# Altium schematic sheet SchemaM02.SchDoc
size A3
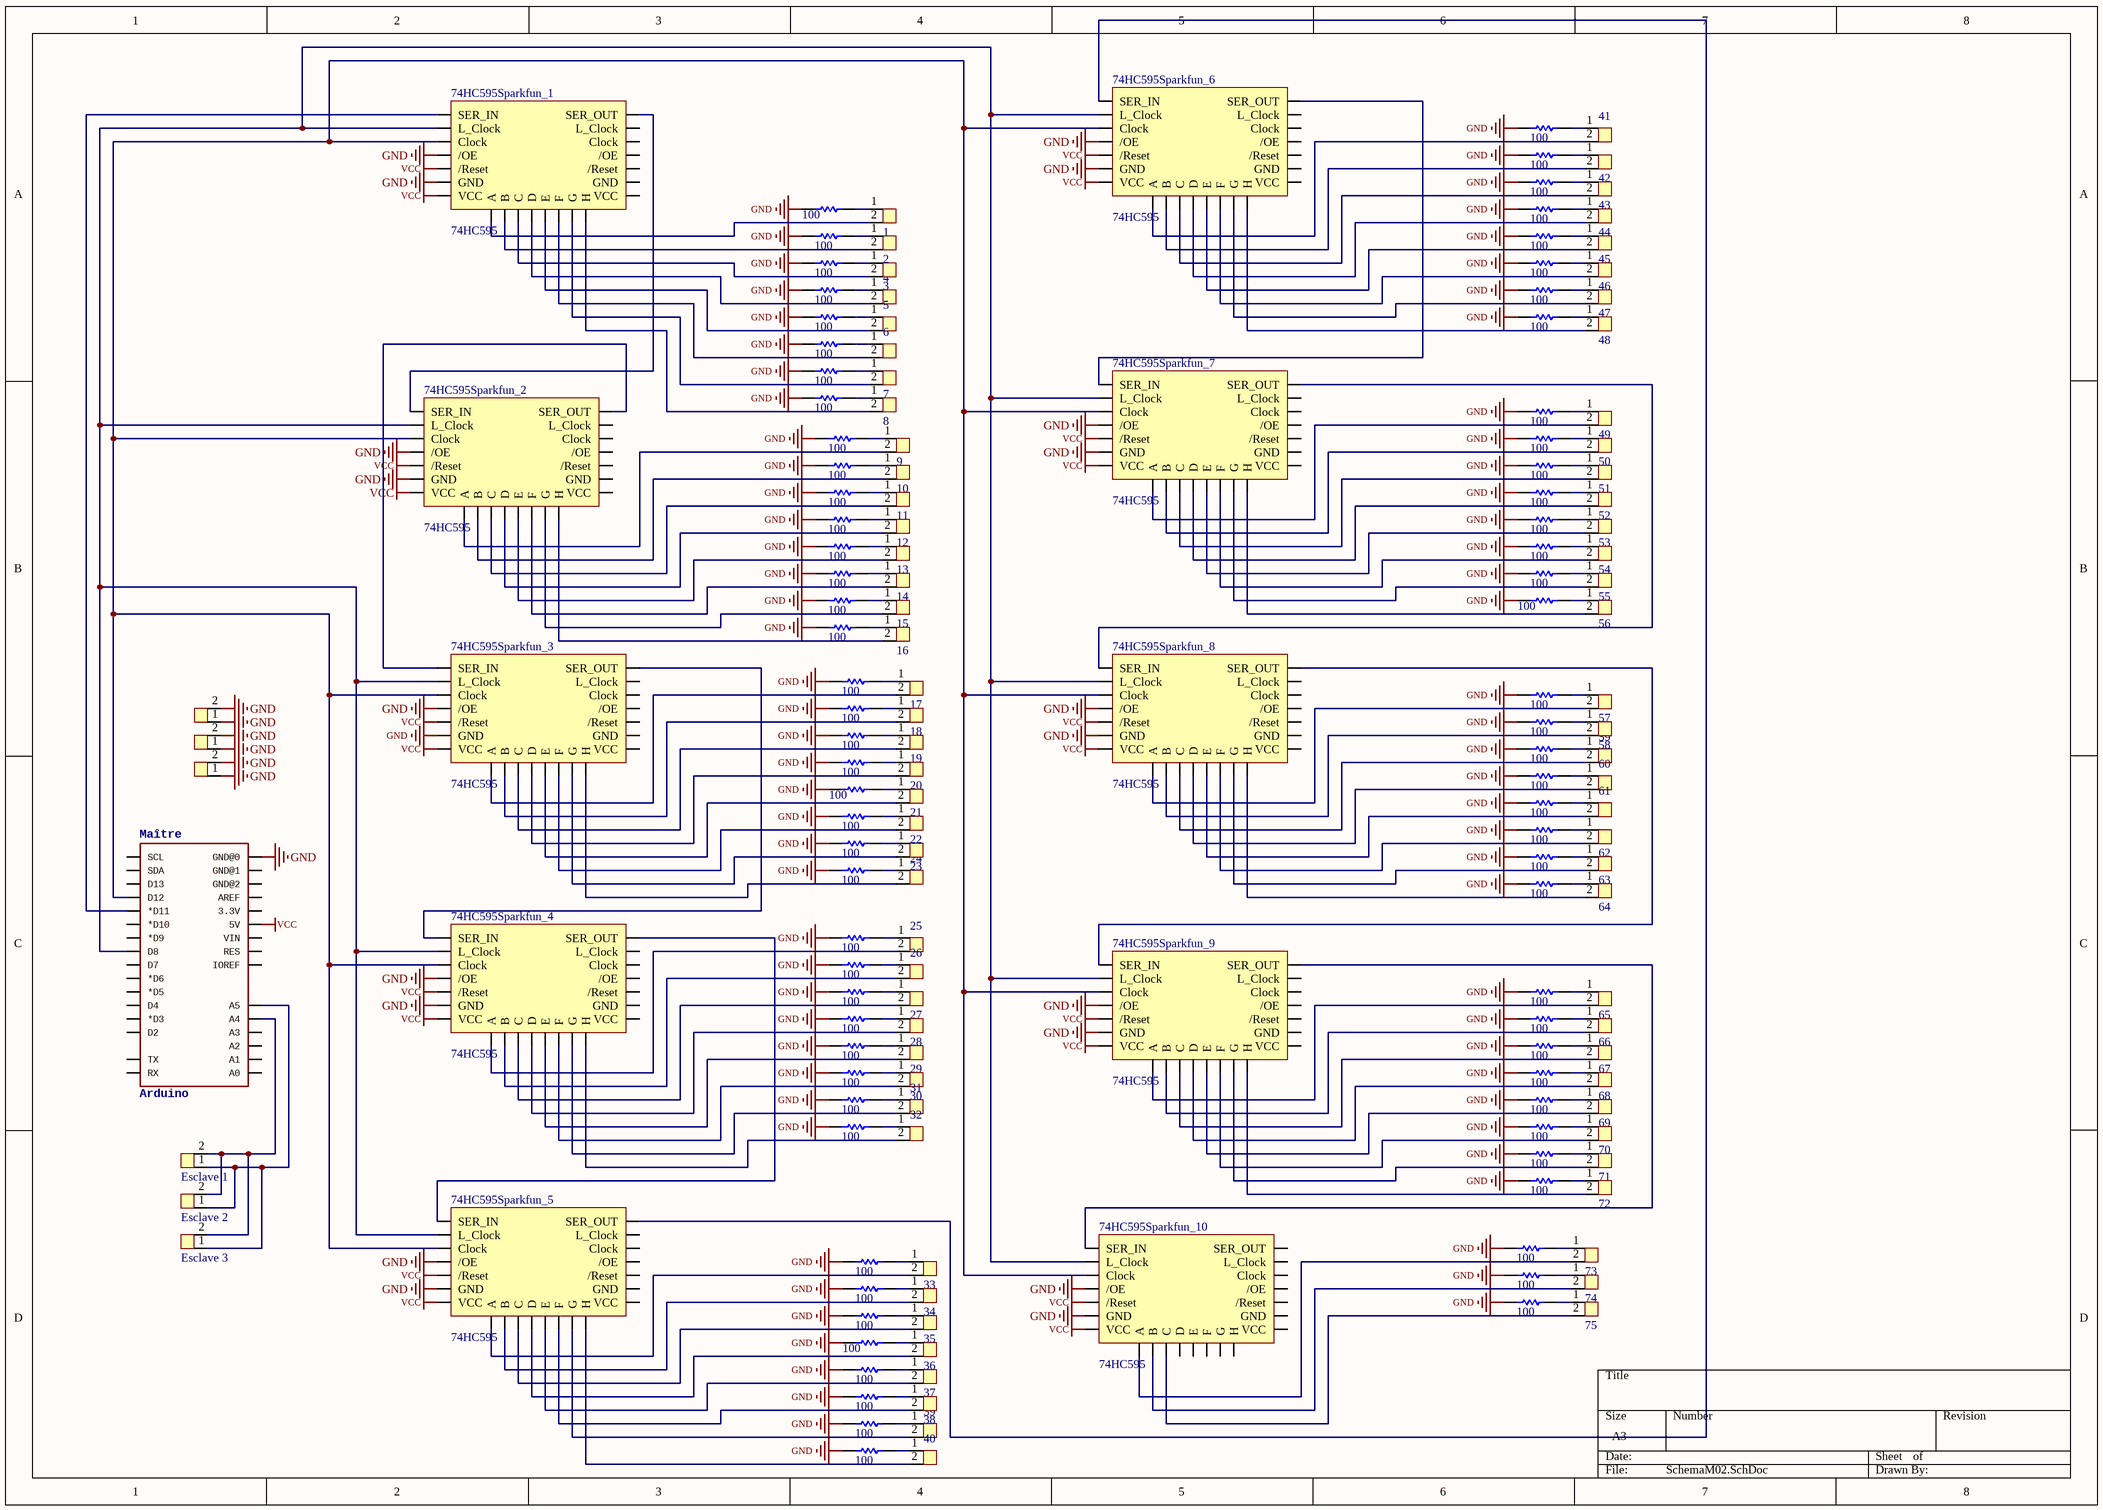
[diagram p0: SchemaM02.SchDoc]

## Parts
1  Embase_CI_2_contacts  [Embase_CI_2_contacts]  (value not drawn)
2  Embase_CI_2_contacts  [Embase_CI_2_contacts]  (value not drawn)
3  Embase_CI_2_contacts  [Embase_CI_2_contacts]  (value not drawn)
4  Embase_CI_2_contacts  [Embase_CI_2_contacts]  (value not drawn)
5  Embase_CI_2_contacts  [Embase_CI_2_contacts]  (value not drawn)
6  Embase_CI_2_contacts  [Embase_CI_2_contacts]  (value not drawn)
7  Embase_CI_2_contacts  [Embase_CI_2_contacts]  (value not drawn)
8  Embase_CI_2_contacts  [Embase_CI_2_contacts]  (value not drawn)
9  Embase_CI_2_contacts  [Embase_CI_2_contacts]  (value not drawn)
10  Embase_CI_2_contacts  [Embase_CI_2_contacts]  (value not drawn)
11  Embase_CI_2_contacts  [Embase_CI_2_contacts]  (value not drawn)
12  Embase_CI_2_contacts  [Embase_CI_2_contacts]  (value not drawn)
13  Embase_CI_2_contacts  [Embase_CI_2_contacts]  (value not drawn)
14  Embase_CI_2_contacts  [Embase_CI_2_contacts]  (value not drawn)
15  Embase_CI_2_contacts  [Embase_CI_2_contacts]  (value not drawn)
16  Embase_CI_2_contacts  [Embase_CI_2_contacts]  (value not drawn)
17  Embase_CI_2_contacts  [Embase_CI_2_contacts]  (value not drawn)
18  Embase_CI_2_contacts  [Embase_CI_2_contacts]  (value not drawn)
19  Embase_CI_2_contacts  [Embase_CI_2_contacts]  (value not drawn)
20  Embase_CI_2_contacts  [Embase_CI_2_contacts]  (value not drawn)
21  Embase_CI_2_contacts  [Embase_CI_2_contacts]  (value not drawn)
22  Embase_CI_2_contacts  [Embase_CI_2_contacts]  (value not drawn)
23  Embase_CI_2_contacts  [Embase_CI_2_contacts]  (value not drawn)
24  Embase_CI_2_contacts  [Embase_CI_2_contacts]  (value not drawn)
25  Embase_CI_2_contacts  [Embase_CI_2_contacts]  (value not drawn)
26  Embase_CI_2_contacts  [Embase_CI_2_contacts]  (value not drawn)
27  Embase_CI_2_contacts  [Embase_CI_2_contacts]  (value not drawn)
28  Embase_CI_2_contacts  [Embase_CI_2_contacts]  (value not drawn)
29  Embase_CI_2_contacts  [Embase_CI_2_contacts]  (value not drawn)
30  Embase_CI_2_contacts  [Embase_CI_2_contacts]  (value not drawn)
31  Embase_CI_2_contacts  [Embase_CI_2_contacts]  (value not drawn)
32  Embase_CI_2_contacts  [Embase_CI_2_contacts]  (value not drawn)
33  Embase_CI_2_contacts  [Embase_CI_2_contacts]  (value not drawn)
34  Embase_CI_2_contacts  [Embase_CI_2_contacts]  (value not drawn)
35  Embase_CI_2_contacts  [Embase_CI_2_contacts]  (value not drawn)
36  Embase_CI_2_contacts  [Embase_CI_2_contacts]  (value not drawn)
37  Embase_CI_2_contacts  [Embase_CI_2_contacts]  (value not drawn)
38  Embase_CI_2_contacts  [Embase_CI_2_contacts]  (value not drawn)
39  Embase_CI_2_contacts  [Embase_CI_2_contacts]  (value not drawn)
40  Embase_CI_2_contacts  [Embase_CI_2_contacts]  (value not drawn)
41  Embase_CI_2_contacts  [Embase_CI_2_contacts]  (value not drawn)
42  Embase_CI_2_contacts  [Embase_CI_2_contacts]  (value not drawn)
43  Embase_CI_2_contacts  [Embase_CI_2_contacts]  (value not drawn)
44  Embase_CI_2_contacts  [Embase_CI_2_contacts]  (value not drawn)
45  Embase_CI_2_contacts  [Embase_CI_2_contacts]  (value not drawn)
46  Embase_CI_2_contacts  [Embase_CI_2_contacts]  (value not drawn)
47  Embase_CI_2_contacts  [Embase_CI_2_contacts]  (value not drawn)
48  Embase_CI_2_contacts  [Embase_CI_2_contacts]  (value not drawn)
49  Embase_CI_2_contacts  [Embase_CI_2_contacts]  (value not drawn)
50  Embase_CI_2_contacts  [Embase_CI_2_contacts]  (value not drawn)
51  Embase_CI_2_contacts  [Embase_CI_2_contacts]  (value not drawn)
52  Embase_CI_2_contacts  [Embase_CI_2_contacts]  (value not drawn)
53  Embase_CI_2_contacts  [Embase_CI_2_contacts]  (value not drawn)
54  Embase_CI_2_contacts  [Embase_CI_2_contacts]  (value not drawn)
55  Embase_CI_2_contacts  [Embase_CI_2_contacts]  (value not drawn)
56  Embase_CI_2_contacts  [Embase_CI_2_contacts]  (value not drawn)
57  Embase_CI_2_contacts  [Embase_CI_2_contacts]  (value not drawn)
58  Embase_CI_2_contacts  [Embase_CI_2_contacts]  (value not drawn)
59  Embase_CI_2_contacts  [Embase_CI_2_contacts]  (value not drawn)
60  Embase_CI_2_contacts  [Embase_CI_2_contacts]  (value not drawn)
61  Embase_CI_2_contacts  [Embase_CI_2_contacts]  (value not drawn)
62  Embase_CI_2_contacts  [Embase_CI_2_contacts]  (value not drawn)
63  Embase_CI_2_contacts  [Embase_CI_2_contacts]  (value not drawn)
64  Embase_CI_2_contacts  [Embase_CI_2_contacts]  (value not drawn)
65  Embase_CI_2_contacts  [Embase_CI_2_contacts]  (value not drawn)
66  Embase_CI_2_contacts  [Embase_CI_2_contacts]  (value not drawn)
67  Embase_CI_2_contacts  [Embase_CI_2_contacts]  (value not drawn)
68  Embase_CI_2_contacts  [Embase_CI_2_contacts]  (value not drawn)
69  Embase_CI_2_contacts  [Embase_CI_2_contacts]  (value not drawn)
70  Embase_CI_2_contacts  [Embase_CI_2_contacts]  (value not drawn)
71  Embase_CI_2_contacts  [Embase_CI_2_contacts]  (value not drawn)
72  Embase_CI_2_contacts  [Embase_CI_2_contacts]  (value not drawn)
73  Embase_CI_2_contacts  [Embase_CI_2_contacts]  (value not drawn)
74  Embase_CI_2_contacts  [Embase_CI_2_contacts]  (value not drawn)
74HC595Sparkfun_1  74HC595  [74HC595]
74HC595Sparkfun_2  74HC595  [74HC595]
74HC595Sparkfun_3  74HC595  [74HC595]
74HC595Sparkfun_4  74HC595  [74HC595]
74HC595Sparkfun_5  74HC595  [74HC595]
74HC595Sparkfun_6  74HC595  [74HC595]
74HC595Sparkfun_7  74HC595  [74HC595]
74HC595Sparkfun_8  74HC595  [74HC595]
74HC595Sparkfun_9  74HC595  [74HC595]
74HC595Sparkfun_10  74HC595  [74HC595]
75  Embase_CI_2_contacts  [Embase_CI_2_contacts]  (value not drawn)
Esclave_1  Embase_CI_2_contacts  [Embase_CI_2_contacts]  (value not drawn)
Esclave_2  Embase_CI_2_contacts  [Embase_CI_2_contacts]  (value not drawn)
Esclave_3  Embase_CI_2_contacts  [Embase_CI_2_contacts]  (value not drawn)
Esclave_4  Embase_CI_2_contacts  [Embase_CI_2_contacts]  (value not drawn)
Esclave_5  Embase_CI_2_contacts  [Embase_CI_2_contacts]  (value not drawn)
Esclave_6  Embase_CI_2_contacts  [Embase_CI_2_contacts]  (value not drawn)
Maître  Arduino  [UNO_R3_SHIELD]
R1  value 100  [AXIAL-0.3]  (hidden comment: Res1)
R2  value 100  [AXIAL-0.3]  (hidden comment: Res1)
R3  value 100  [AXIAL-0.3]  (hidden comment: Res1)
R4  value 100  [AXIAL-0.3]  (hidden comment: Res1)
R5  value 100  [AXIAL-0.3]  (hidden comment: Res1)
R6  value 100  [AXIAL-0.3]  (hidden comment: Res1)
R7  value 100  [AXIAL-0.3]  (hidden comment: Res1)
R8  value 100  [AXIAL-0.3]  (hidden comment: Res1)
R9  value 100  [AXIAL-0.3]  (hidden comment: Res1)
R10  value 100  [AXIAL-0.3]  (hidden comment: Res1)
R11  value 100  [AXIAL-0.3]  (hidden comment: Res1)
R12  value 100  [AXIAL-0.3]  (hidden comment: Res1)
R13  value 100  [AXIAL-0.3]  (hidden comment: Res1)
R14  value 100  [AXIAL-0.3]  (hidden comment: Res1)
R15  value 100  [AXIAL-0.3]  (hidden comment: Res1)
R16  value 100  [AXIAL-0.3]  (hidden comment: Res1)
R17  value 100  [AXIAL-0.3]  (hidden comment: Res1)
R18  value 100  [AXIAL-0.3]  (hidden comment: Res1)
R19  value 100  [AXIAL-0.3]  (hidden comment: Res1)
R20  value 100  [AXIAL-0.3]  (hidden comment: Res1)
R21  value 100  [AXIAL-0.3]  (hidden comment: Res1)
R22  value 100  [AXIAL-0.3]  (hidden comment: Res1)
R23  value 100  [AXIAL-0.3]  (hidden comment: Res1)
R24  value 100  [AXIAL-0.3]  (hidden comment: Res1)
R25  value 100  [AXIAL-0.3]  (hidden comment: Res1)
R26  value 100  [AXIAL-0.3]  (hidden comment: Res1)
R27  value 100  [AXIAL-0.3]  (hidden comment: Res1)
R28  value 100  [AXIAL-0.3]  (hidden comment: Res1)
R29  value 100  [AXIAL-0.3]  (hidden comment: Res1)
R30  value 100  [AXIAL-0.3]  (hidden comment: Res1)
R31  value 100  [AXIAL-0.3]  (hidden comment: Res1)
R32  value 100  [AXIAL-0.3]  (hidden comment: Res1)
R33  value 100  [AXIAL-0.3]  (hidden comment: Res1)
R34  value 100  [AXIAL-0.3]  (hidden comment: Res1)
R35  value 100  [AXIAL-0.3]  (hidden comment: Res1)
R36  value 100  [AXIAL-0.3]  (hidden comment: Res1)
R37  value 100  [AXIAL-0.3]  (hidden comment: Res1)
R38  value 100  [AXIAL-0.3]  (hidden comment: Res1)
R39  value 100  [AXIAL-0.3]  (hidden comment: Res1)
R40  value 100  [AXIAL-0.3]  (hidden comment: Res1)
R41  value 100  [AXIAL-0.3]  (hidden comment: Res1)
R42  value 100  [AXIAL-0.3]  (hidden comment: Res1)
R43  value 100  [AXIAL-0.3]  (hidden comment: Res1)
R44  value 100  [AXIAL-0.3]  (hidden comment: Res1)
R45  value 100  [AXIAL-0.3]  (hidden comment: Res1)
R46  value 100  [AXIAL-0.3]  (hidden comment: Res1)
R47  value 100  [AXIAL-0.3]  (hidden comment: Res1)
R48  value 100  [AXIAL-0.3]  (hidden comment: Res1)
R49  value 100  [AXIAL-0.3]  (hidden comment: Res1)
R50  value 100  [AXIAL-0.3]  (hidden comment: Res1)
R51  value 100  [AXIAL-0.3]  (hidden comment: Res1)
R52  value 100  [AXIAL-0.3]  (hidden comment: Res1)
R53  value 100  [AXIAL-0.3]  (hidden comment: Res1)
R54  value 100  [AXIAL-0.3]  (hidden comment: Res1)
R55  value 100  [AXIAL-0.3]  (hidden comment: Res1)
R56  value 100  [AXIAL-0.3]  (hidden comment: Res1)
R57  value 100  [AXIAL-0.3]  (hidden comment: Res1)
R58  value 100  [AXIAL-0.3]  (hidden comment: Res1)
R59  value 100  [AXIAL-0.3]  (hidden comment: Res1)
R60  value 100  [AXIAL-0.3]  (hidden comment: Res1)
R61  value 100  [AXIAL-0.3]  (hidden comment: Res1)
R62  value 100  [AXIAL-0.3]  (hidden comment: Res1)
R63  value 100  [AXIAL-0.3]  (hidden comment: Res1)
R64  value 100  [AXIAL-0.3]  (hidden comment: Res1)
R65  value 100  [AXIAL-0.3]  (hidden comment: Res1)
R66  value 100  [AXIAL-0.3]  (hidden comment: Res1)
R67  value 100  [AXIAL-0.3]  (hidden comment: Res1)
R68  value 100  [AXIAL-0.3]  (hidden comment: Res1)
R69  value 100  [AXIAL-0.3]  (hidden comment: Res1)
R70  value 100  [AXIAL-0.3]  (hidden comment: Res1)
R71  value 100  [AXIAL-0.3]  (hidden comment: Res1)
R72  value 100  [AXIAL-0.3]  (hidden comment: Res1)
R73  value 100  [AXIAL-0.3]  (hidden comment: Res1)
R74  value 100  [AXIAL-0.3]  (hidden comment: Res1)
R75  value 100  [AXIAL-0.3]  (hidden comment: Res1)

## Nets
GND: 74HC595Sparkfun_1.2(GND) 74HC595Sparkfun_1.4(/OE) 74HC595Sparkfun_2.2(GND) 74HC595Sparkfun_2.4(/OE) 74HC595Sparkfun_3.2(GND) 74HC595Sparkfun_3.4(/OE) 74HC595Sparkfun_4.2(GND) 74HC595Sparkfun_4.4(/OE) 74HC595Sparkfun_5.2(GND) 74HC595Sparkfun_5.4(/OE) 74HC595Sparkfun_6.2(GND) 74HC595Sparkfun_6.4(/OE) 74HC595Sparkfun_7.2(GND) 74HC595Sparkfun_7.4(/OE) 74HC595Sparkfun_8.2(GND) 74HC595Sparkfun_8.4(/OE) 74HC595Sparkfun_9.2(GND) 74HC595Sparkfun_9.4(/OE) 74HC595Sparkfun_10.2(GND) 74HC595Sparkfun_10.4(/OE) Esclave_4.1 Esclave_4.2 Esclave_5.1 Esclave_5.2 Esclave_6.1 Esclave_6.2 Maître.GND@0 R1.1 R2.1 R3.1 R4.1 R5.1 R6.1 R7.1 R8.1 R9.1 R10.1 R11.1 R12.1 R13.1 R14.1 R15.1 R16.1 R17.1 R18.1 R19.1 R20.1 R21.1 R22.1 R23.1 R24.1 R25.1 R26.1 R27.1 R28.1 R29.1 R30.1 R31.1 R32.1 R33.1 R34.1 R35.1 R36.1 R37.1 R38.1 R39.1 R40.1 R41.1 R42.1 R43.1 R44.1 R45.1 R46.1 R47.1 R48.1 R49.1 R50.1 R51.1 R52.1 R53.1 R54.1 R55.1 R56.1 R57.1 R58.1 R59.1 R60.1 R61.1 R62.1 R63.1 R64.1 R65.1 R66.1 R67.1 R68.1 R69.1 R70.1 R71.1 R72.1 R73.1 R74.1 R75.1
VCC: 74HC595Sparkfun_1.1(VCC) 74HC595Sparkfun_1.3(/Reset) 74HC595Sparkfun_2.1(VCC) 74HC595Sparkfun_2.3(/Reset) 74HC595Sparkfun_3.1(VCC) 74HC595Sparkfun_3.3(/Reset) 74HC595Sparkfun_4.1(VCC) 74HC595Sparkfun_4.3(/Reset) 74HC595Sparkfun_5.1(VCC) 74HC595Sparkfun_5.3(/Reset) 74HC595Sparkfun_6.1(VCC) 74HC595Sparkfun_6.3(/Reset) 74HC595Sparkfun_7.1(VCC) 74HC595Sparkfun_7.3(/Reset) 74HC595Sparkfun_8.1(VCC) 74HC595Sparkfun_8.3(/Reset) 74HC595Sparkfun_9.1(VCC) 74HC595Sparkfun_9.3(/Reset) 74HC595Sparkfun_10.1(VCC) 74HC595Sparkfun_10.3(/Reset) Maître.5V
Net1_1: 1.1 R1.2
Net1_2: 1.2 74HC595Sparkfun_1.15(A)
Net2_1: 2.1 R2.2
Net2_2: 2.2 74HC595Sparkfun_1.16(B)
Net3_1: 3.1 R3.2
Net3_2: 3.2 74HC595Sparkfun_1.17(C)
Net4_1: 4.1 R4.2
Net4_2: 4.2 74HC595Sparkfun_1.18(D)
Net5_1: 5.1 R5.2
Net5_2: 5.2 74HC595Sparkfun_1.19(E)
Net6_1: 6.1 R6.2
Net6_2: 6.2 74HC595Sparkfun_1.20(F)
Net7_1: 7.1 R7.2
Net7_2: 7.2 74HC595Sparkfun_1.21(G)
Net8_1: 8.1 R8.2
Net8_2: 8.2 74HC595Sparkfun_1.22(H)
Net9_1: 9.1 R9.2
Net9_2: 9.2 74HC595Sparkfun_2.15(A)
Net10_1: 10.1 R10.2
Net10_2: 10.2 74HC595Sparkfun_2.16(B)
Net11_1: 11.1 R11.2
Net11_2: 11.2 74HC595Sparkfun_2.17(C)
Net12_1: 12.1 R12.2
Net12_2: 12.2 74HC595Sparkfun_2.18(D)
Net13_1: 13.1 R13.2
Net13_2: 13.2 74HC595Sparkfun_2.19(E)
Net14_1: 14.1 R14.2
Net14_2: 14.2 74HC595Sparkfun_2.20(F)
Net15_1: 15.1 R15.2
Net15_2: 15.2 74HC595Sparkfun_2.21(G)
Net16_1: 16.1 R16.2
Net16_2: 16.2 74HC595Sparkfun_2.22(H)
Net17_1: 17.1 R17.2
Net17_2: 17.2 74HC595Sparkfun_3.15(A)
Net18_1: 18.1 R18.2
Net18_2: 18.2 74HC595Sparkfun_3.16(B)
Net19_1: 19.1 R19.2
Net19_2: 19.2 74HC595Sparkfun_3.17(C)
Net20_1: 20.1 R20.2
Net20_2: 20.2 74HC595Sparkfun_3.18(D)
Net21_1: 21.1 R21.2
Net21_2: 21.2 74HC595Sparkfun_3.19(E)
Net22_1: 22.1 R22.2
Net22_2: 22.2 74HC595Sparkfun_3.20(F)
Net23_1: 23.1 R23.2
Net23_2: 23.2 74HC595Sparkfun_3.21(G)
Net24_1: 24.1 R24.2
Net24_2: 24.2 74HC595Sparkfun_3.22(H)
Net25_1: 25.1 R25.2
Net25_2: 25.2 74HC595Sparkfun_4.15(A)
Net26_1: 26.1 R26.2
Net26_2: 26.2 74HC595Sparkfun_4.16(B)
Net27_1: 27.1 R27.2
Net27_2: 27.2 74HC595Sparkfun_4.17(C)
Net28_1: 28.1 R28.2
Net28_2: 28.2 74HC595Sparkfun_4.18(D)
Net29_1: 29.1 R29.2
Net29_2: 29.2 74HC595Sparkfun_4.19(E)
Net30_1: 30.1 R30.2
Net30_2: 30.2 74HC595Sparkfun_4.20(F)
Net31_1: 31.1 R31.2
Net31_2: 31.2 74HC595Sparkfun_4.21(G)
Net32_1: 32.1 R32.2
Net32_2: 32.2 74HC595Sparkfun_4.22(H)
Net33_1: 33.1 R33.2
Net33_2: 33.2 74HC595Sparkfun_5.15(A)
Net34_1: 34.1 R34.2
Net34_2: 34.2 74HC595Sparkfun_5.16(B)
Net35_1: 35.1 R35.2
Net35_2: 35.2 74HC595Sparkfun_5.17(C)
Net36_1: 36.1 R36.2
Net36_2: 36.2 74HC595Sparkfun_5.18(D)
Net37_1: 37.1 R37.2
Net37_2: 37.2 74HC595Sparkfun_5.19(E)
Net38_1: 38.1 R38.2
Net38_2: 38.2 74HC595Sparkfun_5.20(F)
Net39_1: 39.1 R39.2
Net39_2: 39.2 74HC595Sparkfun_5.21(G)
Net40_1: 40.1 R40.2
Net40_2: 40.2 74HC595Sparkfun_5.22(H)
Net41_1: 41.1 R41.2
Net41_2: 41.2 74HC595Sparkfun_6.15(A)
Net42_1: 42.1 R42.2
Net42_2: 42.2 74HC595Sparkfun_6.16(B)
Net43_1: 43.1 R43.2
Net43_2: 43.2 74HC595Sparkfun_6.17(C)
Net44_1: 44.1 R44.2
Net44_2: 44.2 74HC595Sparkfun_6.18(D)
Net45_1: 45.1 R45.2
Net45_2: 45.2 74HC595Sparkfun_6.19(E)
Net46_1: 46.1 R46.2
Net46_2: 46.2 74HC595Sparkfun_6.20(F)
Net47_1: 47.1 R47.2
Net47_2: 47.2 74HC595Sparkfun_6.21(G)
Net48_1: 48.1 R48.2
Net48_2: 48.2 74HC595Sparkfun_6.22(H)
Net49_1: 49.1 R49.2
Net49_2: 49.2 74HC595Sparkfun_7.15(A)
Net50_1: 50.1 R50.2
Net50_2: 50.2 74HC595Sparkfun_7.16(B)
Net51_1: 51.1 R51.2
Net51_2: 51.2 74HC595Sparkfun_7.17(C)
Net52_1: 52.1 R52.2
Net52_2: 52.2 74HC595Sparkfun_7.18(D)
Net53_1: 53.1 R53.2
Net53_2: 53.2 74HC595Sparkfun_7.19(E)
Net54_1: 54.1 R54.2
Net54_2: 54.2 74HC595Sparkfun_7.20(F)
Net55_1: 55.1 R55.2
Net55_2: 55.2 74HC595Sparkfun_7.21(G)
Net56_1: 56.1 R56.2
Net56_2: 56.2 74HC595Sparkfun_7.22(H)
Net57_1: 57.1 R57.2
Net57_2: 57.2 74HC595Sparkfun_8.15(A)
Net58_1: 58.1 R58.2
Net58_2: 58.2 74HC595Sparkfun_8.16(B)
Net59_1: 59.1 R59.2
Net59_2: 59.2 74HC595Sparkfun_8.17(C)
Net60_1: 60.1 R60.2
Net60_2: 60.2 74HC595Sparkfun_8.18(D)
Net61_1: 61.1 R61.2
Net61_2: 61.2 74HC595Sparkfun_8.19(E)
Net62_1: 62.1 R62.2
Net62_2: 62.2 74HC595Sparkfun_8.20(F)
Net63_1: 63.1 R63.2
Net63_2: 63.2 74HC595Sparkfun_8.21(G)
Net64_1: 64.1 R64.2
Net64_2: 64.2 74HC595Sparkfun_8.22(H)
Net65_1: 65.1 R65.2
Net65_2: 65.2 74HC595Sparkfun_9.15(A)
Net66_1: 66.1 R66.2
Net66_2: 66.2 74HC595Sparkfun_9.16(B)
Net67_1: 67.1 R67.2
Net67_2: 67.2 74HC595Sparkfun_9.17(C)
Net68_1: 68.1 R68.2
Net68_2: 68.2 74HC595Sparkfun_9.18(D)
Net69_1: 69.1 R69.2
Net69_2: 69.2 74HC595Sparkfun_9.19(E)
Net70_1: 70.1 R70.2
Net70_2: 70.2 74HC595Sparkfun_9.20(F)
Net71_1: 71.1 R71.2
Net71_2: 71.2 74HC595Sparkfun_9.21(G)
Net72_1: 72.1 R72.2
Net72_2: 72.2 74HC595Sparkfun_9.22(H)
Net73_1: 73.1 R73.2
Net73_2: 73.2 74HC595Sparkfun_10.15(A)
Net74_1: 74.1 R74.2
Net74_2: 74.2 74HC595Sparkfun_10.16(B)
Net74HC595Sparkfun_1_5: 74HC595Sparkfun_1.5(Clock) 74HC595Sparkfun_2.5(Clock) 74HC595Sparkfun_3.5(Clock) 74HC595Sparkfun_4.5(Clock) 74HC595Sparkfun_5.5(Clock) 74HC595Sparkfun_6.5(Clock) 74HC595Sparkfun_7.5(Clock) 74HC595Sparkfun_8.5(Clock) 74HC595Sparkfun_9.5(Clock) 74HC595Sparkfun_10.5(Clock) Maître.D12
Net74HC595Sparkfun_1_6: 74HC595Sparkfun_1.6(L_Clock) 74HC595Sparkfun_2.6(L_Clock) 74HC595Sparkfun_3.6(L_Clock) 74HC595Sparkfun_4.6(L_Clock) 74HC595Sparkfun_5.6(L_Clock) 74HC595Sparkfun_6.6(L_Clock) 74HC595Sparkfun_7.6(L_Clock) 74HC595Sparkfun_8.6(L_Clock) 74HC595Sparkfun_9.6(L_Clock) 74HC595Sparkfun_10.6(L_Clock) Maître.D8
Net74HC595Sparkfun_1_7: 74HC595Sparkfun_1.7(SER_IN) Maître.D11(*D11)
Net74HC595Sparkfun_1_14: 74HC595Sparkfun_1.14(SER_OUT) 74HC595Sparkfun_2.7(SER_IN)
Net74HC595Sparkfun_2_14: 74HC595Sparkfun_2.14(SER_OUT) 74HC595Sparkfun_3.7(SER_IN)
Net74HC595Sparkfun_3_14: 74HC595Sparkfun_3.14(SER_OUT) 74HC595Sparkfun_4.7(SER_IN)
Net74HC595Sparkfun_4_14: 74HC595Sparkfun_4.14(SER_OUT) 74HC595Sparkfun_5.7(SER_IN)
Net74HC595Sparkfun_5_14: 74HC595Sparkfun_5.14(SER_OUT) 74HC595Sparkfun_6.7(SER_IN)
Net74HC595Sparkfun_6_14: 74HC595Sparkfun_6.14(SER_OUT) 74HC595Sparkfun_7.7(SER_IN)
Net74HC595Sparkfun_7_14: 74HC595Sparkfun_7.14(SER_OUT) 74HC595Sparkfun_8.7(SER_IN)
Net74HC595Sparkfun_8_14: 74HC595Sparkfun_8.14(SER_OUT) 74HC595Sparkfun_9.7(SER_IN)
Net74HC595Sparkfun_9_14: 74HC595Sparkfun_9.14(SER_OUT) 74HC595Sparkfun_10.7(SER_IN)
Net74HC595Sparkfun_10_17: 74HC595Sparkfun_10.17(C) 75.2
Net75_1: 75.1 R75.2
NetEsclave_1_1: Esclave_1.1 Esclave_2.1 Esclave_3.1 Maître.A5
NetEsclave_1_2: Esclave_1.2 Esclave_2.2 Esclave_3.2 Maître.A4

Not connected (* = marked no-connect by the designer): 74HC595Sparkfun_1 8(VCC) 9(GND) 10(/Reset) 11(/OE) 12(Clock) 13(L_Clock); 74HC595Sparkfun_2 8(VCC) 9(GND) 10(/Reset) 11(/OE) 12(Clock) 13(L_Clock); 74HC595Sparkfun_3 8(VCC) 9(GND) 10(/Reset) 11(/OE) 12(Clock) 13(L_Clock); 74HC595Sparkfun_4 8(VCC) 9(GND) 10(/Reset) 11(/OE) 12(Clock) 13(L_Clock); 74HC595Sparkfun_5 8(VCC) 9(GND) 10(/Reset) 11(/OE) 12(Clock) 13(L_Clock); 74HC595Sparkfun_6 8(VCC) 9(GND) 10(/Reset) 11(/OE) 12(Clock) 13(L_Clock); 74HC595Sparkfun_7 8(VCC) 9(GND) 10(/Reset) 11(/OE) 12(Clock) 13(L_Clock); 74HC595Sparkfun_8 8(VCC) 9(GND) 10(/Reset) 11(/OE) 12(Clock) 13(L_Clock); 74HC595Sparkfun_9 8(VCC) 9(GND) 10(/Reset) 11(/OE) 12(Clock) 13(L_Clock); 74HC595Sparkfun_10 8(VCC) 9(GND) 10(/Reset) 11(/OE) 12(Clock) 13(L_Clock) 14(SER_OUT) 18(D) 19(E) 20(F) 21(G) 22(H); Maître 3.3V A0 A1 A2 A3 AREF D2 D3(*D3) D4 D5(*D5) D6(*D6) D7 D9(*D9) D10(*D10) D13 GND@1 GND@2 IOREF RES RX SCL SDA TX VIN

## Library data of the parts
Maître = ARDUINO_R3_SHIELD
R1-R75 = Res1: Resistor; Published: 8-Jun-2000; LatestRevisionDate: 17-Jul-2002; LatestRevisionNote: Re-released for DXP Platform.; PackageReference: AXIAL-0.3; Publisher: Altium Limited; PackageDescription: Axial Device, Thru-Hole; 2 Leads; 0.3 in Pin Spacing